# EAGLE design O-schematic (EAGLE 9.5.2)
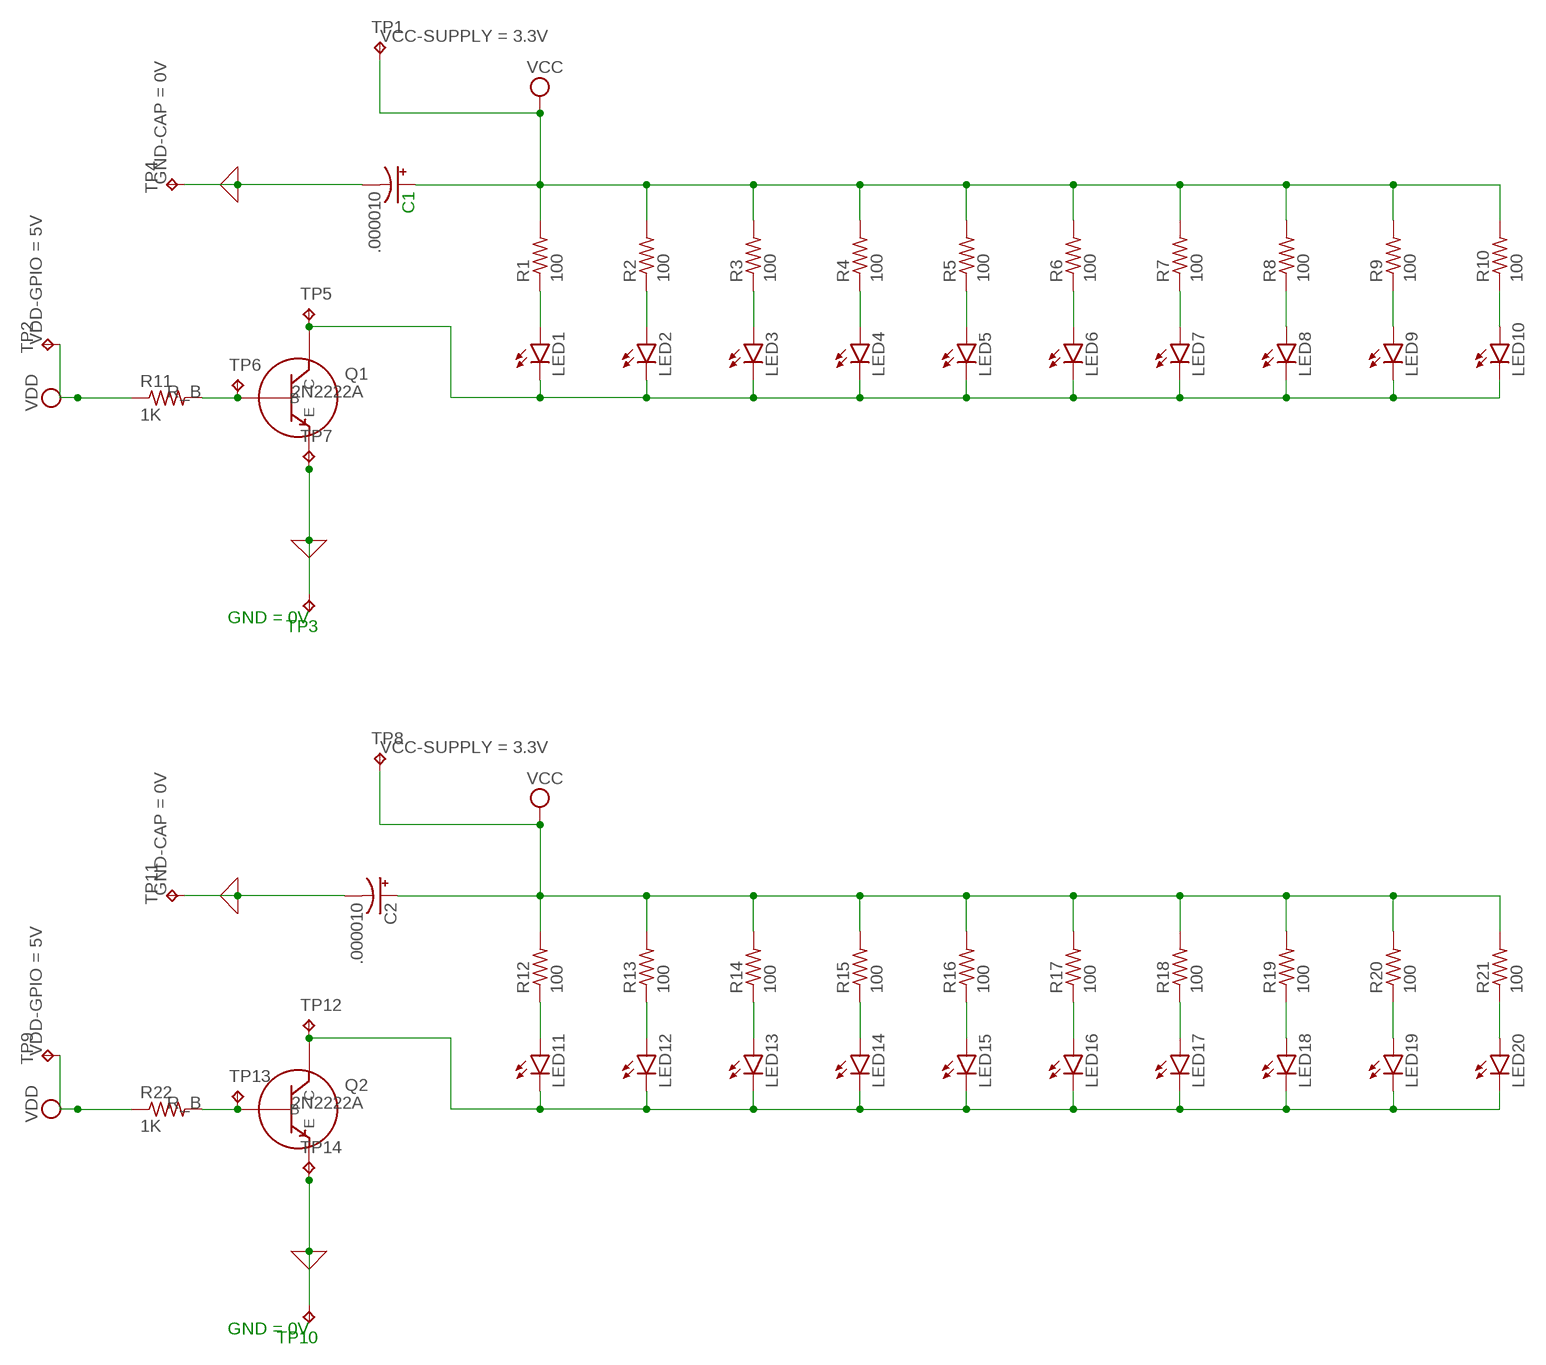
[diagram p0: schematic, sheet 1]

## Parts
C1  .000010  CPOL-USE2.5-6  [E2,5-6]
C2  .000010  CPOL-USE2.5-5  [E2,5-5]
LED1  LEDCHIPLED-0603-TTW  [CHIPLED-0603-TTW]
LED2  LEDCHIPLED-0603-TTW  [CHIPLED-0603-TTW]
LED3  LEDCHIPLED-0603-TTW  [CHIPLED-0603-TTW]
LED4  LEDCHIPLED-0603-TTW  [CHIPLED-0603-TTW]
LED5  LEDCHIPLED-0603-TTW  [CHIPLED-0603-TTW]
LED6  LEDCHIPLED-0603-TTW  [CHIPLED-0603-TTW]
LED7  LEDCHIPLED-0603-TTW  [CHIPLED-0603-TTW]
LED8  LEDCHIPLED-0603-TTW  [CHIPLED-0603-TTW]
LED9  LEDCHIPLED-0603-TTW  [CHIPLED-0603-TTW]
LED10  LEDCHIPLED-0603-TTW  [CHIPLED-0603-TTW]
LED11  LEDCHIPLED-0603-TTW  [CHIPLED-0603-TTW]
LED12  LEDCHIPLED-0603-TTW  [CHIPLED-0603-TTW]
LED13  LEDCHIPLED-0603-TTW  [CHIPLED-0603-TTW]
LED14  LEDCHIPLED-0603-TTW  [CHIPLED-0603-TTW]
LED15  LEDCHIPLED-0603-TTW  [CHIPLED-0603-TTW]
LED16  LEDCHIPLED-0603-TTW  [CHIPLED-0603-TTW]
LED17  LEDCHIPLED-0603-TTW  [CHIPLED-0603-TTW]
LED18  LEDCHIPLED-0603-TTW  [CHIPLED-0603-TTW]
LED19  LEDCHIPLED-0603-TTW  [CHIPLED-0603-TTW]
LED20  LEDCHIPLED-0603-TTW  [CHIPLED-0603-TTW]
Q1  BJT_NPN  (no package)
Q2  BJT_NPN  (no package)
R1  100  R-US_R0603  [R0603]
R2  100  R-US_R0603  [R0603]
R3  100  R-US_R0603  [R0603]
R4  100  R-US_R0603  [R0603]
R5  100  R-US_R0603  [R0603]
R6  100  R-US_R0603  [R0603]
R7  100  R-US_R0603  [R0603]
R8  100  R-US_R0603  [R0603]
R9  100  R-US_R0603  [R0603]
R10  100  R-US_R0603  [R0603]
R11  1K  R-US_R0603  [R0603]
R12  100  R-US_R0603  [R0603]
R13  100  R-US_R0603  [R0603]
R14  100  R-US_R0603  [R0603]
R15  100  R-US_R0603  [R0603]
R16  100  R-US_R0603  [R0603]
R17  100  R-US_R0603  [R0603]
R18  100  R-US_R0603  [R0603]
R19  100  R-US_R0603  [R0603]
R20  100  R-US_R0603  [R0603]
R21  100  R-US_R0603  [R0603]
R22  1K  R-US_R0603  [R0603]
TP1  TPPAD1-13Y  [P1-13Y]
TP2  TPPAD1-13Y  [P1-13Y]
TP3  TPPAD1-13Y  [P1-13Y]
TP4  TPPAD1-13Y  [P1-13Y]
TP5  TPPAD1-13  [P1-13]
TP6  TPPAD1-13  [P1-13]
TP7  TPPAD1-13  [P1-13]
TP8  TPPAD1-13Y  [P1-13Y]
TP9  TPPAD1-13Y  [P1-13Y]
TP10  TPPAD1-13Y  [P1-13Y]
TP11  TPPAD1-13Y  [P1-13Y]
TP12  TPPAD1-13  [P1-13]
TP13  TPPAD1-13  [P1-13]
TP14  TPPAD1-13  [P1-13]

## Nets
0: C1.- C2.- Q1.E Q2.E TP3.TP TP4.TP TP7.TP TP10.TP TP11.TP TP14.TP ; supply symbol labelled GND
N$1: Q1.B R11.2 TP6.TP
N$2: LED1.C@1(C) LED2.C@1(C) LED3.C@1(C) LED4.C@1(C) LED5.C@1(C) LED6.C@1(C) LED7.C@1(C) LED8.C@1(C) LED9.C@1(C) LED10.C@1(C) Q1.C TP5.TP
N$3: LED1.A@1(A) R1.1
N$4: LED2.A@1(A) R2.1
N$5: LED3.A@1(A) R3.1
N$6: LED4.A@1(A) R4.1
N$7: LED5.A@1(A) R5.1
N$8: LED6.A@1(A) R6.1
N$9: LED7.A@1(A) R7.1
N$10: LED10.A@1(A) R10.1
N$11: LED9.A@1(A) R9.1
N$12: LED8.A@1(A) R8.1
N$13: Q2.B R22.2 TP13.TP
N$14: LED11.C@1(C) LED12.C@1(C) LED13.C@1(C) LED14.C@1(C) LED15.C@1(C) LED16.C@1(C) LED17.C@1(C) LED18.C@1(C) LED19.C@1(C) LED20.C@1(C) Q2.C TP12.TP
N$15: LED11.A@1(A) R12.1
N$16: LED12.A@1(A) R13.1
N$17: LED13.A@1(A) R14.1
N$18: LED14.A@1(A) R15.1
N$19: LED15.A@1(A) R16.1
N$20: LED16.A@1(A) R17.1
N$21: LED17.A@1(A) R18.1
N$22: LED20.A@1(A) R21.1
N$23: LED19.A@1(A) R20.1
N$24: LED18.A@1(A) R19.1
VCC: C1.+ C2.+ R1.2 R2.2 R3.2 R4.2 R5.2 R6.2 R7.2 R8.2 R9.2 R10.2 R12.2 R13.2 R14.2 R15.2 R16.2 R17.2 R18.2 R19.2 R20.2 R21.2 TP1.TP TP8.TP
VDD: R11.1 R22.1 TP2.TP TP9.TP

## Library data of the parts
C1 C2 = rcl:CPOL-US: POLARIZED CAPACITOR, American symbol; SPICEPREFIX: C
LED1 LED2 LED11 LED12 = led:LED: LED OSRAM: - CHIPLED LG R971, LG N971, LY N971, LG Q971, LY Q971, LO R971, LY R971 LH N974, LH R974 LS Q976, LO Q976, LY Q976 LO Q996 - Hyper CHIPLED LW Q18S LB Q993, LB Q99A, LB R99A - SideLED LS A670, LO A670, LY A670, LG A670, LP A670 LB A673, LV A673, LT A673, LW A673 LH A674 LY A675 LS A676, LA A676, LO A676, LY A676, LW A676 LS A679, LY A679, LG A679 - Hyper Micro SIDELED® LS Y876, LA Y876, LO Y876, LY Y876 LT Y87S - SmartLED LW L88C, LW L88S LB L89C, LB L89S, LG L890 LS L89K, LO L89K, LY L89K LS L896, LA L896, LO L896, LY L896 - TOPLED LS T670, LO T670, LY T670, LG T670, LP T670 LSG T670, LSP T670, LSY T670, LOP T670, LYG T670 LG T671, LOG T671, LSG T671 LB T673, LV T673, LT T673, LW T673 LH T674 LS T676, LA T676, LO T676, LY T676, LB T676, LH T676, LSB T676, LW T676 LB T67C, LV T67C, LT T67C, LS T67K, LO T67K, LY T67K, LW E67C LS E67B, LA E67B, LO E67B, LY E67B, LB E67C, LV E67C, LT E67C LW T67C LS T679, LY T679, LG T679 LS T770, LO T770, LY T770, LG T770, LP T770 LB T773, LV T773, LT T773, LW T773 LH T774 LS E675, LA E675, LY E675, LS T675 LS T776, LA T776, LO T776, LY T776, LB T776 LHGB T686 LT T68C, LB T68C - Hyper Mini TOPLED® LB M676 - Mini TOPLED Santana® LG M470 LS M47K, LO M47K, LY M47K Source: http://www.osram.convergy.de LUXEON: - LUMILED® LXK2-PW12-R00, LXK2-PW12-S00, LXK2-PW14-U00, LXK2-PW14-V00 LXK2-PM12-R00, LXK2-PM12-S00, LXK2-PM14-U00 LXK2-PE12-Q00, LXK2-PE12-R00, LXK2-PE12-S00, LXK2-PE14-T00, LXK2-PE14-U00 LXK2-PB12-K00, LXK2-PB12-L00, LXK2-PB12-M00, LXK2-PB14-N00, LXK2-PB14-P00, LXK2-PB14-Q00 LXK2-PR12-L00, LXK2-PR12-M00, LXK2-PR14-Q00, LXK2-PR14-R00 LXK2-PD12-Q00, LXK2-PD12-R00, LXK2-PD12-S00 LXK2-PH12-R00, LXK2-PH12-S00 LXK2-PL12-P00, LXK2-PL12-Q00, LXK2-PL12-R00 Source: www.luxeon.com KINGBRIGHT: KA-3528ASYC Source: www.kingbright.com; SPICEPREFIX: L
LED3-LED10 LED13-LED20 = led:LED: LED OSRAM: - CHIPLED LG R971, LG N971, LY N971, LG Q971, LY Q971, LO R971, LY R971 LH N974, LH R974 LS Q976, LO Q976, LY Q976 LO Q996 - Hyper CHIPLED LW Q18S LB Q993, LB Q99A, LB R99A - SideLED LS A670, LO A670, LY A670, LG A670, LP A670 LB A673, LV A673, LT A673, LW A673 LH A674 LY A675 LS A676, LA A676, LO A676, LY A676, LW A676 LS A679, LY A679, LG A679 - Hyper Micro SIDELED® LS Y876, LA Y876, LO Y876, LY Y876 LT Y87S - SmartLED LW L88C, LW L88S LB L89C, LB L89S, LG L890 LS L89K, LO L89K, LY L89K LS L896, LA L896, LO L896, LY L896 - TOPLED LS T670, LO T670, LY T670, LG T670, LP T670 LSG T670, LSP T670, LSY T670, LOP T670, LYG T670 LG T671, LOG T671, LSG T671 LB T673, LV T673, LT T673, LW T673 LH T674 LS T676, LA T676, LO T676, LY T676, LB T676, LH T676, LSB T676, LW T676 LB T67C, LV T67C, LT T67C, LS T67K, LO T67K, LY T67K, LW E67C LS E67B, LA E67B, LO E67B, LY E67B, LB E67C, LV E67C, LT E67C LW T67C LS T679, LY T679, LG T679 LS T770, LO T770, LY T770, LG T770, LP T770 LB T773, LV T773, LT T773, LW T773 LH T774 LS E675, LA E675, LY E675, LS T675 LS T776, LA T776, LO T776, LY T776, LB T776 LHGB T686 LT T68C, LB T68C - Hyper Mini TOPLED® LB M676 - Mini TOPLED Santana® LG M470 LS M47K, LO M47K, LY M47K Source: http://www.osram.convergy.de LUXEON: - LUMILED® LXK2-PW12-R00, LXK2-PW12-S00, LXK2-PW14-U00, LXK2-PW14-V00 LXK2-PM12-R00, LXK2-PM12-S00, LXK2-PM14-U00 LXK2-PE12-Q00, LXK2-PE12-R00, LXK2-PE12-S00, LXK2-PE14-T00, LXK2-PE14-U00 LXK2-PB12-K00, LXK2-PB12-L00, LXK2-PB12-M00, LXK2-PB14-N00, LXK2-PB14-P00, LXK2-PB14-Q00 LXK2-PR12-L00, LXK2-PR12-M00, LXK2-PR14-Q00, LXK2-PR14-R00 LXK2-PD12-Q00, LXK2-PD12-R00, LXK2-PD12-S00 LXK2-PH12-R00, LXK2-PH12-S00 LXK2-PL12-P00, LXK2-PL12-Q00, LXK2-PL12-R00 Source: www.luxeon.com KINGBRIGHT: KA-3528ASYC Source: www.kingbright.com
Q1 Q2 = ngspice-simulation:BJT_NPN: Bipolar NPN Transistor; SPICEPREFIX: Q
R1-R10 R12-R21 = rcl:R-US_: RESISTOR, American symbol; SPICEPREFIX: R
R11 R22 = rcl:R-US_: RESISTOR, American symbol; R_B: 1K; SPICEPREFIX: R
TP1 TP8 = testpad:TP: Test pad; VCC-SUPPLY: 3.3V
TP2 TP9 = testpad:TP: Test pad; VDD-GPIO: 5V
TP3 TP10 = testpad:TP: Test pad; GND: 0V
TP4 TP11 = testpad:TP: Test pad; GND-CAP: 0V
TP5-TP7 TP12-TP14 = testpad:TP: Test pad

## Net classes
0 default: clearance 0.205 mm

## Board
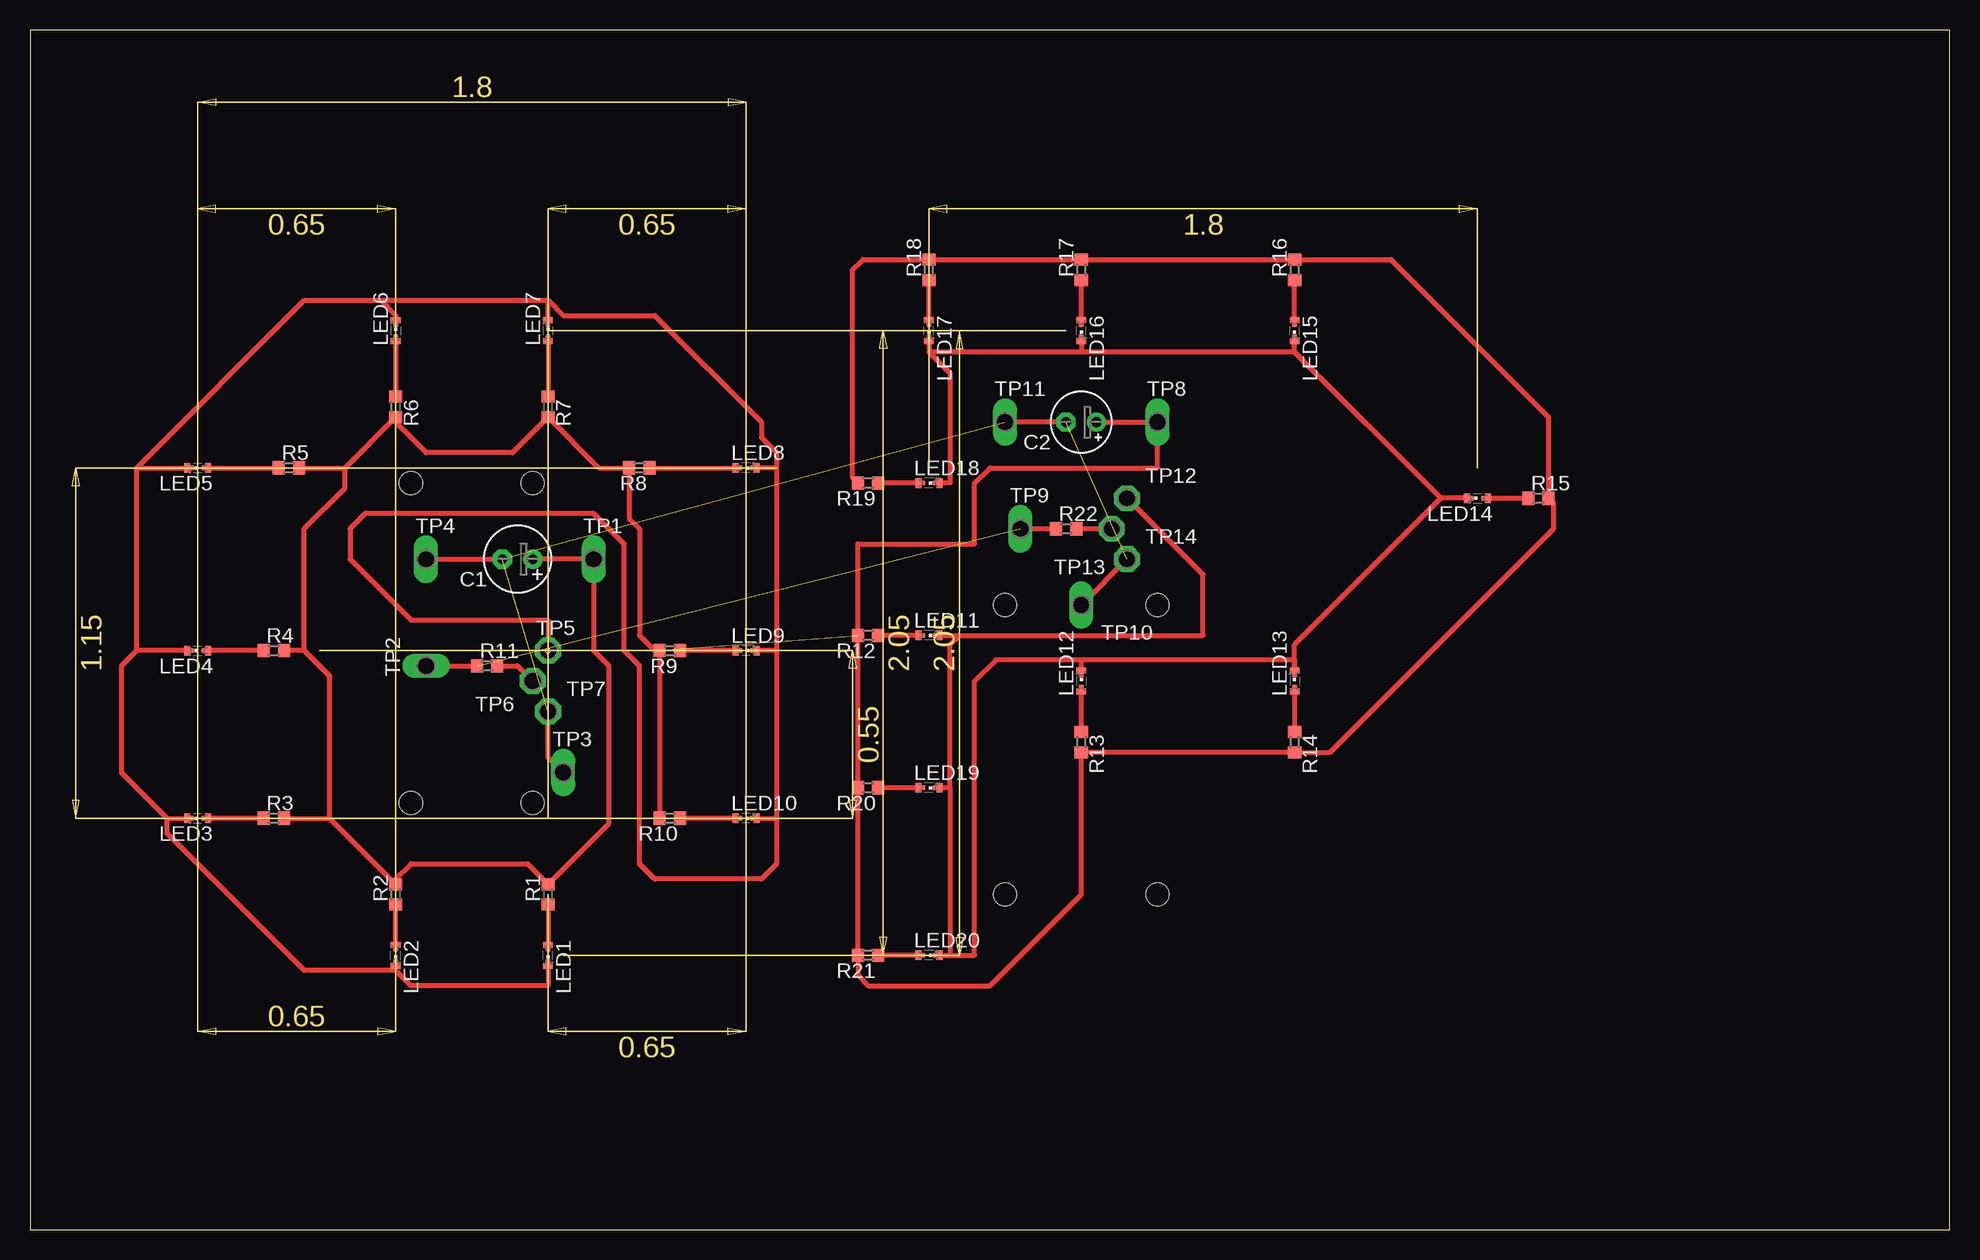
[diagram p1: board, top side]

Size 160 x 100 mm. Coordinates in mm from the lower left corner, seen from the top.
Outline: 0,0 160,0 160,100 0,100 0,0
Copper layers (1*16): Top 0.035mm / dielectric 1.5mm / Bottom 0.035mm
Design rules "default": minimum track width 6mil, minimum drill 0.35mm, track to track 6mil, track to pad 6mil, pad to pad 6mil, via to via 6mil, smd to smd 6mil, copper to edge 40mil, drill to drill 6mil, minimum pad ring 10mil, minimum via ring 8mil, stop-mask expansion 4mil, vias tented up to drill 0mil, thermal gap 10mil
Holes 0.35 mm at 43.18,48.26
Holes 1.91 mm at 31.75,62.23 41.91,62.23 31.75,35.56 41.91,35.56 81.28,52.07 93.98,52.07 93.98,27.94 81.28,27.94

### Footprints (pad centres in the part's own frame; a part is rotated, then mirrored left to right if it is on the bottom)
E2,5-6 = drill 0.813 pad 1.6: + -1.27,0 | drill 0.813 pad 1.6 octagon: - 1.27,0
E2,5-5 = drill 0.813 pad 1.6: + -1.27,0 | drill 0.813 pad 1.6 octagon: - 1.27,0
CHIPLED-0603-TTW = smd 0.8 x 0.5: A 0,-0.875; C 0,0.875 | smd 0.35 x 0.35: A@1 0,-0.5; C@1 0,0.5
R0603 = smd 1 x 1.1: 1 -0.85,0; 2 0.85,0
P1-13Y = drill 1.321 pad 1.905 long: TP 0,0
P1-13 = drill 1.321 pad 2.159 octagon: TP 0,0

### Placement (x,y rotation side)
C1  40.64,55.88 180 top
C2  87.63,67.31 180 top
LED1  43.18,22.86 180 top
LED2  30.48,22.86 180 top
LED3  13.97,34.29 90 top
LED4  13.97,48.26 90 top
LED5  13.97,63.5 90 top
LED6  30.48,74.93 0 top
LED7  43.18,74.93 0 top
LED8  59.69,63.5 270 top
LED9  59.69,48.26 270 top
LED10  59.69,34.29 270 top
LED11  74.93,49.53 270 top
LED12  87.63,45.72 0 top
LED13  105.41,45.72 0 top
LED14  120.65,60.96 90 top
LED15  105.41,74.93 180 top
LED16  87.63,74.93 180 top
LED17  74.93,74.93 180 top
LED18  74.93,62.23 270 top
LED19  74.93,36.83 270 top
LED20  74.93,22.86 270 top
R1  43.18,27.94 90 top
R2  30.48,27.94 90 top
R3  20.32,34.29 0 top
R4  20.32,48.26 0 top
R5  21.59,63.5 0 top
R6  30.48,68.58 270 top
R7  43.18,68.58 270 top
R8  50.8,63.5 180 top
R9  53.34,48.26 180 top
R10  53.34,34.29 180 top
R11  38.1,46.99 0 top
R12  69.85,49.53 180 top
R13  87.63,40.64 270 top
R14  105.41,40.64 270 top
R15  125.73,60.96 0 top
R16  105.41,80.01 90 top
R17  87.63,80.01 90 top
R18  74.93,80.01 90 top
R19  69.85,62.23 180 top
R20  69.85,36.83 180 top
R21  69.85,22.86 180 top
R22  86.36,58.42 0 top
TP1  46.99,55.88 0 top
TP2  33.02,46.99 90 top
TP3  44.45,38.1 0 top
TP4  33.02,55.88 0 top
TP5  43.18,48.26 0 top
TP6  41.91,45.72 0 top
TP7  43.18,43.18 0 top
TP8  93.98,67.31 0 top
TP9  82.55,58.42 0 top
TP10  87.63,52.07 0 top
TP11  81.28,67.31 0 top
TP12  91.44,60.96 0 top
TP13  90.17,58.42 0 top
TP14  91.44,55.88 0 top

### Tracks (layer width: path | path; a pad name or v marks a point on that pad's centre or on a via)
0  (3 unrouted)
  Top 0.406: TP4.TP C1.- | TP3.TP 43.18,39.37 TP7.TP | TP14.TP TP10.TP | C2.- TP11.TP
N$1
  Top 0.406: R11.2 40.64,46.99 TP6.TP
N$2
  Top 0.406: LED1.C@1 43.18,20.32 31.75,20.32 30.48,21.59 | LED2.C@1 30.48,21.59 | 30.48,21.59 22.86,21.59 11.43,33.02 11.43,34.29 | 11.43,34.29 LED3.C@1 | LED4.C@1 8.89,48.26 | 8.89,48.26 7.62,46.99 7.62,38.1 11.43,34.29 | 29.21,77.47 30.48,76.2 LED6.C@1 | 29.21,77.47 43.18,77.47 | 43.18,77.47 44.45,76.2 52.07,76.2 60.96,67.31 60.96,66.04 62.23,64.77 62.23,63.5 | LED7.C@1 43.18,77.47 | 62.23,48.26 62.23,34.29 | 62.23,34.29 62.23,30.48 60.96,29.21 52.07,29.21 50.8,30.48 50.8,46.99 49.53,48.26 49.53,57.15 46.99,59.69 27.94,59.69 26.67,58.42 26.67,55.88 31.75,50.8 43.18,50.8 TP5.TP | 62.23,63.5 LED8.C@1 | 62.23,63.5 62.23,48.26 | 62.23,48.26 LED9.C@1 | LED10.C@1 62.23,34.29 | 8.89,48.26 8.89,63.5 | 8.89,63.5 LED5.C@1 | 8.89,63.5 22.86,77.47 29.21,77.47
N$3
  Top 0.406: R1.1 LED1.A@1
N$4
  Top 0.406: LED2.A@1 R2.1
N$5
  Top 0.406: R3.1 LED3.A@1
N$6
  Top 0.406: R4.1 LED4.A@1
N$7
  Top 0.406: LED5.A@1 R5.1
N$8
  Top 0.406: LED6.A@1 R6.1
N$9
  Top 0.406: LED7.A@1 R7.1
N$10  (1 unrouted)
  Top 0.406: LED10.A@1 R10.1
N$11
  Top 0.406: LED9.A@1 R9.1
N$12
  Top 0.406: R8.1 LED8.A@1
N$13
  Top 0.406: R22.2 TP13.TP
N$14
  Top 0.406: LED12.C@1 87.63,47.49 | 87.63,47.49 105.41,47.49 LED13.C@1 105.41,48.76 117.61,60.96 | LED14.C@1 117.61,60.96 | 117.61,60.96 105.41,73.16 | LED16.C@1 87.63,73.16 | 105.41,73.16 87.63,73.16 | 105.41,73.16 LED15.C@1 | 87.63,73.16 74.93,73.16 | LED17.C@1 74.93,73.16 | 74.93,73.16 76.7,71.39 76.7,62.23 LED18.C@1 | 76.7,36.83 LED19.C@1 | 76.7,36.83 76.7,22.86 | LED20.C@1 76.7,22.86 | 76.7,22.86 78.74,22.86 78.74,45.72 80.51,47.49 87.63,47.49 | TP12.TP 97.79,54.61 97.79,49.53 77.47,49.53 | LED11.C@1 77.47,49.53 | 77.47,49.53 76.7,48.76 76.7,36.83
N$15
  Top 0.406: LED11.A@1 R12.1
N$16
  Top 0.406: R13.1 LED12.A@1
N$17
  Top 0.406: LED13.A@1 R14.1
N$18
  Top 0.406: LED14.A@1 R15.1
N$19
  Top 0.406: LED15.A@1 R16.1
N$20
  Top 0.406: LED16.A@1 R17.1
N$21
  Top 0.406: LED17.A@1 R18.1
N$22
  Top 0.406: LED20.A@1 R21.1
N$23
  Top 0.406: LED19.A@1 R20.1
N$24
  Top 0.406: LED18.A@1 R19.1
VCC  (1 unrouted)
  Top 0.406: C1.+ TP1.TP 46.99,48.26 48.26,46.99 48.26,33.87 R1.2 41.49,30.48 31.75,30.48 30.48,29.21 R2.2 24.98,34.29 | R3.2 24.98,34.29 | 24.98,34.29 24.98,46.14 22.86,48.26 | 22.86,48.26 R4.2 | 22.86,48.26 22.86,58.42 26.25,61.81 26.25,63.5 | 26.25,63.5 R6.2 30.48,67.31 33.02,64.77 40.22,64.77 R7.2 47.41,63.5 R8.2 49.95,59.27 50.8,58.42 50.8,49.53 52.07,48.26 R9.2 R10.2 | R5.2 26.25,63.5 | C2.+ TP8.TP 93.98,63.5 80.01,63.5 78.74,62.23 78.74,57.15 69,57.15 R12.2 R20.2 R21.2 69,21.17 69.85,20.32 80.01,20.32 87.63,27.94 R13.2 R14.2 108.37,39.79 127,58.42 127,60.54 R15.2 126.58,67.73 113.45,80.86 R16.2 R17.2 R18.2 69.43,80.86 68.58,80.01 68.58,62.65 R19.2
VDD  (1 unrouted)
  Top 0.406: TP2.TP R11.1 | TP9.TP R22.1